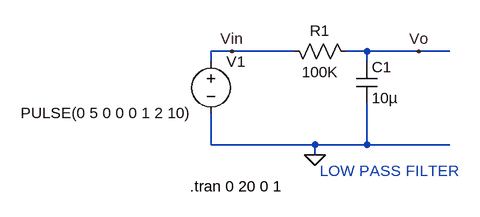
[diagram p0: schematic LOW PASS FILTER CHARGING AND DISCHARGING.asc]
LOW PASS FILTER CHARGING AND DISCHARGING.asc, the LTspice schematic file:
Version 4
SHEET 1 880 680
WIRE 0 128 -32 128
WIRE 96 128 0 128
WIRE 208 128 176 128
WIRE 288 128 208 128
WIRE 336 128 288 128
WIRE -32 144 -32 128
WIRE 208 144 208 128
WIRE -32 272 -32 224
WIRE 128 272 -32 272
WIRE 208 272 208 208
WIRE 208 272 128 272
WIRE 336 272 208 272
WIRE 128 288 128 272
FLAG 128 288 0
FLAG 288 128 Vo
FLAG 0 128 Vin
SYMBOL res 192 144 M270
WINDOW 0 32 56 VTop 2
WINDOW 3 0 56 VBottom 2
SYMATTR InstName R1
SYMATTR Value 100K
SYMBOL cap 192 144 R0
SYMATTR InstName C1
SYMATTR Value 10µ
SYMBOL voltage -32 128 R0
WINDOW 3 -293 95 Left 2
WINDOW 123 24 72 Left 2
WINDOW 39 0 0 Left 2
SYMATTR Value PULSE(0 5 0 0 0 1 2 10)
SYMATTR InstName V1
TEXT 136 312 Left 2 ;LOW PASS FILTER
TEXT -64 336 Left 2 !.tran 0 20 0 1

The netlist it stands for:
* LOW PASS FILTER CHARGING AND DISCHARGING.asc
R1 Vo Vin 100K
C1 Vo 0 10µ
V1 Vin 0 PULSE(0 5 0 0 0 1 2 10)
* LOW PASS FILTER
.tran 0 20 0 1
.backanno
.end

* Results of the author's LTspice run, read from the files saved beside the schematic
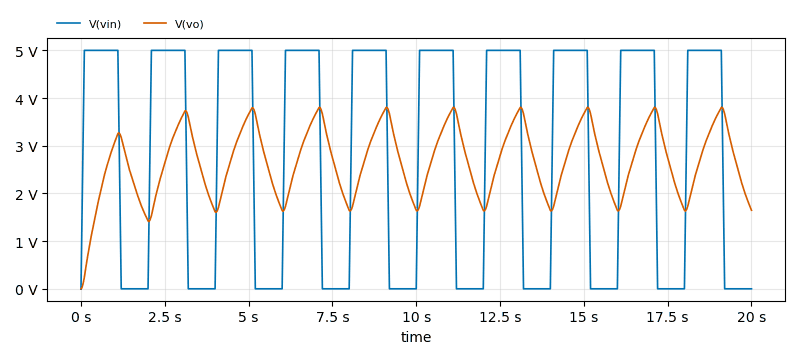
[diagram p1: Transient Analysis of LOW PASS FILTER CHARGING AND DISCHARGING.asc, plotted from the saved traces]
* Transient Analysis, 1 run:
*   V(vin): min 0 V, max 5 V, average 2.75 V, rms 3.657 V, last 0 V
*   V(vo): min 0 V, max 3.806 V, average 2.667 V, rms 2.771 V, last 1.646 V